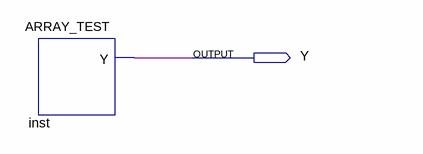
[diagram p0: schematic sheet]
// Quartus schematic top_level.bdf as structural Verilog: 1 symbols, 1 pins
module top_level (
  output Y
);

  ARRAY_TEST inst (.Y(Y));
endmodule
